# Altium project stm32f407vg.PrjPCB
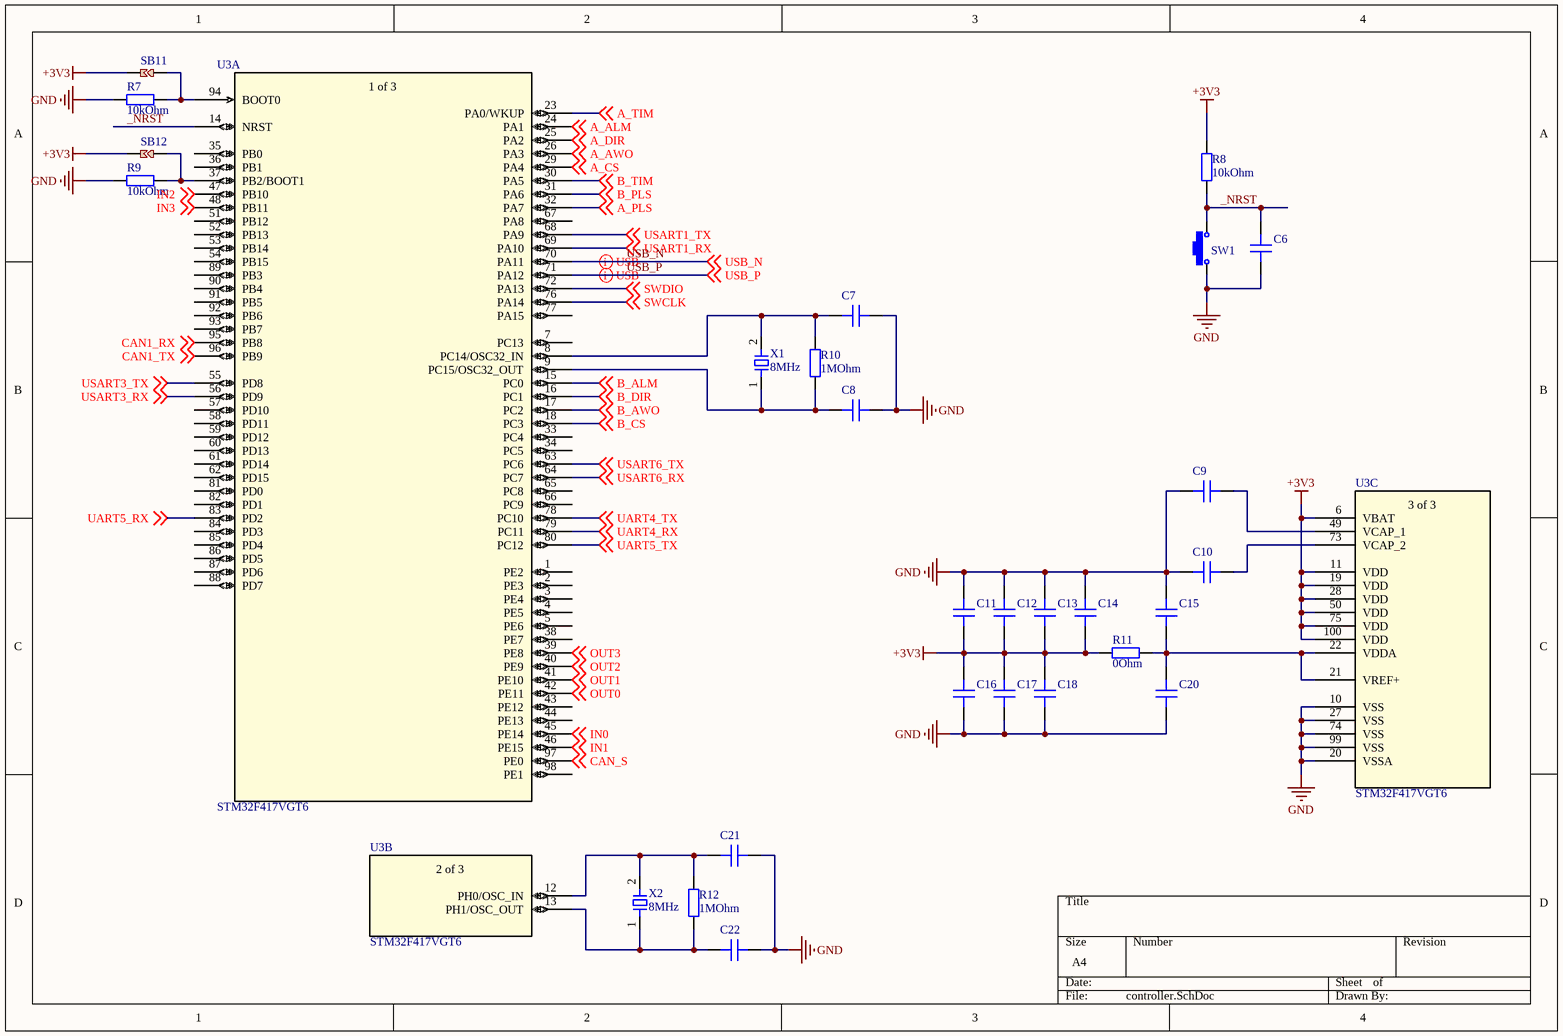
[diagram p0: controller.SchDoc]
5 sheets, 135 parts. Net scope: global (net labels, ports and power ports of the same name join across sheets).
Board file: PCB1.PcbDoc
Sheets:
  controller.SchDoc
  connectivity.SchDoc
  power.SchDoc
  io_TS.SchDoc
  stepper.SchDoc

## Sheet controller.SchDoc
size A4

### Parts
C6  100nF  [CAP 0805]  (value not drawn)
C7  100nF  [CAP 0805]  (value not drawn)
C8  100nF  [CAP 0805]  (value not drawn)
C9  100nF  [CAP 0805]  (value not drawn)
C10  100nF  [CAP 0805]  (value not drawn)
C11  100nF  [CAP 0805]  (value not drawn)
C12  100nF  [CAP 0805]  (value not drawn)
C13  100nF  [CAP 0805]  (value not drawn)
C14  100nF  [CAP 0805]  (value not drawn)
C15  100nF  [CAP 0805]  (value not drawn)
C16  100nF  [CAP 0805]  (value not drawn)
C17  100nF  [CAP 0805]  (value not drawn)
C18  100nF  [CAP 0805]  (value not drawn)
C20  100nF  [CAP 0805]  (value not drawn)
C21  100nF  [CAP 0805]  (value not drawn)
C22  100nF  [CAP 0805]  (value not drawn)
R7  value 10kOhm  [RES 0805]  (hidden comment: Resistor)
R8  value 10kOhm  [RES 0805]  (hidden comment: Resistor)
R9  value 10kOhm  [RES 0805]  (hidden comment: Resistor)
R10  value 1MOhm  [RES 0805]  (hidden comment: Resistor)
R11  value 0Ohm  [RES 0805]  (hidden comment: Resistor)
R12  value 1MOhm  [RES 0805]  (hidden comment: Resistor)
SB11  SB  [Solder Bridge]  (value not drawn)
SB12  SB  [Solder Bridge]  (value not drawn)
SW1  Button  [TSW SMD-3*6*2.5]  (value not drawn)
U3  STM32F417VGT6  [LQFP100-14×14mm]  (parts A,B,C of 3)
X1  8MHz  [XTAL 3215]
X2  8MHz  [XTAL 3225]

### Nets
+3V3: C11.1 C12.1 C13.1 C14.1 C16.2 C17.2 C18.2 R8.2 R11.1 SB11.1 SB12.1 U3.6(VBAT) U3.11(VDD) U3.19(VDD) U3.28(VDD) U3.50(VDD) U3.75(VDD) U3.100(VDD)
GND: C6.1 C7.2 C8.2 C9.2 C10.2 C11.2 C12.2 C13.2 C14.2 C15.2 C16.1 C17.1 C18.1 C20.1 C21.2 C22.2 R7.2 R9.2 SW1.1 U3.10(VSS) U3.20(VSSA) U3.27(VSS) U3.74(VSS) U3.99(VSS)
_NRST: C6.2 R8.1 SW1.2 U3.14(NRST)
A_ALM: U3.24(PA1) ; off-sheet A_ALM
A_AWO: U3.26(PA3) ; off-sheet A_AWO
A_CS: U3.29(PA4) ; off-sheet A_CS
A_DIR: U3.25(PA2) ; off-sheet A_DIR
A_PLS: U3.32(PA7) ; off-sheet A_PLS
A_TIM: U3.23(PA0/WKUP) ; off-sheet A_TIM
B_ALM: U3.15(PC0) ; off-sheet B_ALM
B_AWO: U3.17(PC2) ; off-sheet B_AWO
B_CS: U3.18(PC3) ; off-sheet B_CS
B_DIR: U3.16(PC1) ; off-sheet B_DIR
B_PLS: U3.31(PA6) ; off-sheet B_PLS
B_TIM: U3.30(PA5) ; off-sheet B_TIM
CAN1_RX: U3.95(PB8) ; off-sheet CAN1_RX
CAN1_TX: U3.96(PB9) ; off-sheet CAN1_TX
CAN_S: U3.97(PE0) ; off-sheet CAN_S
IN0: U3.45(PE14) ; off-sheet IN0
IN1: U3.46(PE15) ; off-sheet IN1
IN2: U3.47(PB10) ; off-sheet IN2
IN3: U3.48(PB11) ; off-sheet IN3
OUT0: U3.42(PE11) ; off-sheet OUT0
OUT1: U3.41(PE10) ; off-sheet OUT1
OUT2: U3.40(PE9) ; off-sheet OUT2
OUT3: U3.39(PE8) ; off-sheet OUT3
SWCLK: U3.76(PA14) ; off-sheet SWCLK
SWDIO: U3.72(PA13) ; off-sheet SWDIO
UART4_RX: U3.79(PC11) ; off-sheet UART4_RX
UART4_TX: U3.78(PC10) ; off-sheet UART4_TX
UART5_RX: U3.83(PD2) ; off-sheet UART5_RX
UART5_TX: U3.80(PC12) ; off-sheet UART5_TX
USART1_RX: U3.69(PA10) ; off-sheet USART1_RX
USART1_TX: U3.68(PA9) ; off-sheet USART1_TX
USART3_RX: U3.56(PD9) ; off-sheet USART3_RX
USART3_TX: U3.55(PD8) ; off-sheet USART3_TX
USART6_RX: U3.64(PC7) ; off-sheet USART6_RX
USART6_TX: U3.63(PC6) ; off-sheet USART6_TX
USB_N: U3.70(PA11) ; off-sheet USB_N
USB_P: U3.71(PA12) ; off-sheet USB_P
NetC7_1: C7.1 R10.2 U3.8(PC14/OSC32_IN) X1.2
NetC8_1: C8.1 R10.1 U3.9(PC15/OSC32_OUT) X1.1
NetC9_1: C9.1 U3.49(VCAP_1)
NetC10_1: C10.1 U3.73(VCAP_2)
NetC15_1: C15.1 C20.2 R11.2 U3.21(VREF+) U3.22(VDDA)
NetC21_1: C21.1 R12.2 U3.12(PH0/OSC_IN) X2.2
NetC22_1: C22.1 R12.1 U3.13(PH1/OSC_OUT) X2.1
NetR7_1: R7.1 SB11.2 U3.94(BOOT0)
NetR9_1: R9.1 SB12.2 U3.37(PB2/BOOT1)

Not connected (* = marked no-connect by the designer): U3 1(PE2) 2(PE3) 3(PE4) 4(PE5) 5(PE6) 7(PC13) 33(PC4) 34(PC5) 35(PB0) 36(PB1) 38(PE7) 43(PE12) 44(PE13) 51(PB12) 52(PB13) 53(PB14) 54(PB15) 57(PD10) 58(PD11) 59(PD12) 60(PD13) 61(PD14) 62(PD15) 65(PC8) 66(PC9) 67(PA8) 77(PA15) 81(PD0) 82(PD1) 84(PD3) 85(PD4) 86(PD5) 87(PD6) 88(PD7) 89(PB3) 90(PB4) 91(PB5) 92(PB6) 93(PB7) 98(PE1)

### Layout directives
differential pair: USB_N, USB_P

### Notes on the sheet
- (in symbol STM32F417VGT6, part A) 1 of 3
- (in symbol STM32F417VGT6, part B) 2 of 3
- (in symbol STM32F417VGT6, part C) 3 of 3

### Library data of the parts
C6-C18 C20-C22 = Cap: Non-polar capacitor; Published: 8-Jun-2000; LatestRevisionDate: 17-Jul-2002; LatestRevisionNote: Re-released for DXP Platform.; PackageReference: RAD-0.3; Publisher: Altium Limited; PackageDescription: Radial Cap, Thru-Hole; 2 Leads; 0.3 in Pin Spacing
R7-R12 = Res: Published: 8-Jun-2000; LatestRevisionDate: 17-Jul-2002; LatestRevisionNote: Re-released for DXP Platform.; PackageReference: AXIAL-0.4; Publisher: Altium Limited; PackageDescription: Axial Device, Thru-Hole; 2 Leads; 0.4 in Pin Spacing
SW1 = BTN: BOM名称: 3x6轻触开关; 版权归属: 黎明电子style; 学习资源: https://lmdzstyle.taobao.com/
U3 = STM32F417VGT6: No Description Available; SourceLibrary: Updates_to_database_2020-10-19; Built_By: EMA_UL_Team; Vendor: STMicroelectronics; Copyright: Copyright (C) 2018 Accelerated Designs. All rights reserved; Manufacturer_Part_Number: STM32F417VGT6; RefDes: RefDes; Type: DEV
X1 = XTAL: Passive Oscillator; BOM名称: 2脚晶振; 版权归属: 黎明电子style; 学习资源: https://lmdzstyle.taobao.com/
X2 = XTAL: Passive Oscillator; pin to pad: 2>3; BOM名称: 2脚晶振; 版权归属: 黎明电子style; 学习资源: https://lmdzstyle.taobao.com/

## Sheet connectivity.SchDoc
size A4
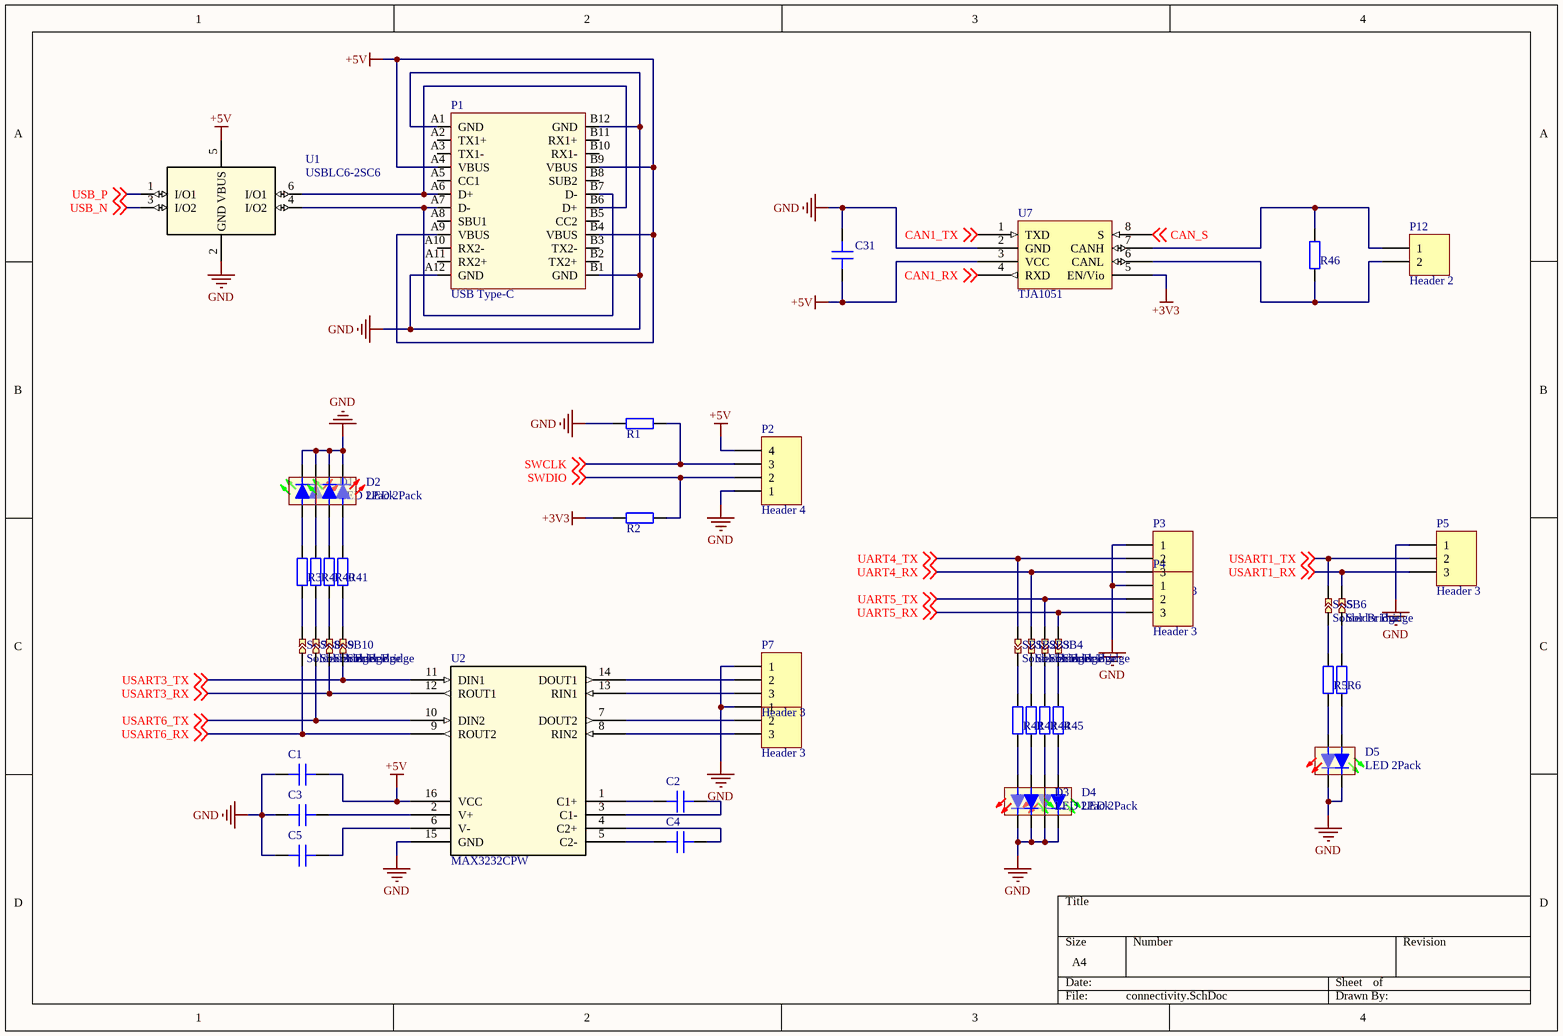
[diagram p1: connectivity.SchDoc]

### Parts
C1  100nF  [CAP 0805]  (value not drawn)
C2  100nF  [CAP 0805]  (value not drawn)
C3  100nF  [CAP 0805]  (value not drawn)
C4  100nF  [CAP 0805]  (value not drawn)
C5  100nF  [CAP 0805]  (value not drawn)
C31  100nF  [CAP 0805]  (value not drawn)
D1  LED 2Pack  [LED-1615]
D2  LED 2Pack  [LED-1615]
D3  LED 2Pack  [LED-1615]
D4  LED 2Pack  [LED-1615]
D5  LED 2Pack  [LED-1615]
P1  USB Type-C  [USB Type-C 24P]
P2  Header 4  [HDR1X4]
P3  Header 3  [MOLEX 53426-0310]
P4  Header 3  [MOLEX 53426-0310]
P5  Header 3  [MOLEX 53426-0310]
P6  Header 3  [MOLEX 53426-0310]
P7  Header 3  [MOLEX 53426-0310]
P12  Header 2  [MOLEX 53426-0210]
R1  10kOhm  [RES 0805]  (value not drawn)
R2  10kOhm  [RES 0805]  (value not drawn)
R3  10kOhm  [RES 0805]  (value not drawn)
R4  10kOhm  [RES 0805]  (value not drawn)
R5  10kOhm  [RES 0805]  (value not drawn)
R6  10kOhm  [RES 0805]  (value not drawn)
R40  10kOhm  [RES 0805]  (value not drawn)
R41  10kOhm  [RES 0805]  (value not drawn)
R42  10kOhm  [RES 0805]  (value not drawn)
R43  10kOhm  [RES 0805]  (value not drawn)
R44  10kOhm  [RES 0805]  (value not drawn)
R45  10kOhm  [RES 0805]  (value not drawn)
R46  10kOhm  [RES 0805]  (value not drawn)
SB1  Solder Bridge  [Solder Bridge]
SB2  Solder Bridge  [Solder Bridge]
SB3  Solder Bridge  [Solder Bridge]
SB4  Solder Bridge  [Solder Bridge]
SB5  Solder Bridge  [Solder Bridge]
SB6  Solder Bridge  [Solder Bridge]
SB7  Solder Bridge  [Solder Bridge]
SB8  Solder Bridge  [Solder Bridge]
SB9  Solder Bridge  [Solder Bridge]
SB10  Solder Bridge  [Solder Bridge]
U1  USBLC6-2SC6  [SOT23-6L_STM]
U2  MAX3232CPW  [TSSOP-16]
U7  TJA1051  [SO-8]

### Nets
+3V3: R2.2 U7.5(EN/Vio)
+5V: C1.2 C31.1 P1.A4(VBUS) P1.A9(VBUS) P1.B4(VBUS) P1.B9(VBUS) P2.4 U1.5(VBUS) U2.16(VCC) U7.3(VCC)
GND: C1.1 C3.1 C5.1 C31.2 D1.1(RK) D1.2(GK) D2.1(RK) D2.2(GK) D3.1(RK) D3.2(GK) D4.1(RK) D4.2(GK) D5.1(RK) D5.2(GK) P1.A1(GND) P1.A12(GND) P1.B1(GND) P1.B12(GND) P2.1 P3.1 P4.1 P5.1 P6.1 P7.1 R1.2 U1.2(GND) U2.15(GND) U7.2(GND)
CAN1_RX: U7.4(RXD) ; off-sheet CAN1_RX
CAN1_TX: U7.1(TXD) ; off-sheet CAN1_TX
CAN_S: U7.8(S) ; off-sheet CAN_S
SWCLK: P2.3 R1.1 ; off-sheet SWCLK
SWDIO: P2.2 R2.1 ; off-sheet SWDIO
UART4_RX: P3.3 SB2.2 ; off-sheet UART4_RX
UART4_TX: P3.2 SB1.2 ; off-sheet UART4_TX
UART5_RX: P4.3 SB4.2 ; off-sheet UART5_RX
UART5_TX: P4.2 SB3.2 ; off-sheet UART5_TX
USART1_RX: P5.3 SB6.1 ; off-sheet USART1_RX
USART1_TX: P5.2 SB5.1 ; off-sheet USART1_TX
USART3_RX: SB9.2 U2.12(ROUT1) ; off-sheet USART3_RX
USART3_TX: SB10.2 U2.11(DIN1) ; off-sheet USART3_TX
USART6_RX: SB7.2 U2.9(ROUT2) ; off-sheet USART6_RX
USART6_TX: SB8.2 U2.10(DIN2) ; off-sheet USART6_TX
USB_N: U1.3(I/O2) ; off-sheet USB_N
USB_P: U1.1(I/O1) ; off-sheet USB_P
NetC2_1: C2.1 U2.1(C1+)
NetC2_2: C2.2 U2.3(C1-)
NetC3_2: C3.2 U2.2(V+)
NetC4_1: C4.1 U2.5(C2-)
NetC4_2: C4.2 U2.4(C2+)
NetC5_2: C5.2 U2.6(V-)
NetD1_3: D1.3(GA) R3.2
NetD1_4: D1.4(RA) R4.2
NetD2_3: D2.3(GA) R40.2
NetD2_4: D2.4(RA) R41.2
NetD3_3: D3.3(GA) R43.1
NetD3_4: D3.4(RA) R42.1
NetD4_3: D4.3(GA) R45.1
NetD4_4: D4.4(RA) R44.1
NetD5_3: D5.3(GA) R6.1
NetD5_4: D5.4(RA) R5.1
NetP1_A6: P1.A6(D+) P1.B6(D+) U1.6(I/O1)
NetP1_A7: P1.A7(D-) P1.B7(D-) U1.4(I/O2)
NetP6_2: P6.2 U2.7(DOUT2)
NetP6_3: P6.3 U2.8(RIN2)
NetP7_2: P7.2 U2.14(DOUT1)
NetP7_3: P7.3 U2.13(RIN1)
NetP12_1: P12.1 R46.1 U7.7(CANH)
NetP12_2: P12.2 R46.2 U7.6(CANL)
NetR3_1: R3.1 SB7.1
NetR4_1: R4.1 SB8.1
NetR5_2: R5.2 SB5.2
NetR6_2: R6.2 SB6.2
NetR40_1: R40.1 SB9.1
NetR41_1: R41.1 SB10.1
NetR42_2: R42.2 SB1.1
NetR43_2: R43.2 SB2.1
NetR44_2: R44.2 SB3.1
NetR45_2: R45.2 SB4.1

Not connected (* = marked no-connect by the designer): P1 A2(TX1+) A3(TX1-) A5(CC1) A8(SBU1) A10(RX2-) A11(RX2+) B2(TX2+) B3(TX2-) B5(CC2) B8(SUB2) B10(RX1-) B11(RX1+)

### Library data of the parts
C1-C5 C31 = Cap: Non-polar capacitor; Published: 8-Jun-2000; LatestRevisionDate: 17-Jul-2002; LatestRevisionNote: Re-released for DXP Platform.; PackageReference: RAD-0.3; Publisher: Altium Limited; PackageDescription: Radial Cap, Thru-Hole; 2 Leads; 0.3 in Pin Spacing
D1-D5 = LED 2Pack: Two seperate LEDs packed together.
P2 = Header 4: Header, 4-Pin; LatestRevisionDate: 17-Jul-2002; LatestRevisionNote: Re-released for DXP Platform.; Publisher: Altium Limited
P3-P7 = Header 3: Header, 3-Pin; LatestRevisionDate: 17-Jul-2002; LatestRevisionNote: Re-released for DXP Platform.; Publisher: Altium Limited
P12 = Header 2: Header, 2-Pin; LatestRevisionDate: 17-Jul-2002; LatestRevisionNote: Re-released for DXP Platform.; Publisher: Altium Limited
R1-R6 R40-R46 = Res: Resistor; Published: 8-Jun-2000; LatestRevisionDate: 17-Jul-2002; LatestRevisionNote: Re-released for DXP Platform.; PackageReference: AXIAL-0.4; Publisher: Altium Limited; PackageDescription: Axial Device, Thru-Hole; 2 Leads; 0.4 in Pin Spacing
U2 = MAX3232CPW: 3-V to 5.5-V Multichannel RS-232 Line Driver/Receiver; Manufacturer: Texas Instruments; INDUSTRY_STD_PKG_TYPE: TSSOP; PIN_COUNT: 16; PACKAGE_DESIGNATOR: PW; Datasheet_URL: http://www.ti.com/lit/gpn/MAX3232; FAMILY_NAME: RS-232; GENERIC_PART_NUMBER: MAX3232; Vendor: Texas Instruments; Manufacturer_Part_Number: MAX3232CPW; Copyright: Copyright (C) 2021 Accelerated Designs. All rights reserved; RefDes: RefDes; Type: DEV
U7 = TJA1051: High-speed CAN transceiver

## Sheet power.SchDoc
size A4
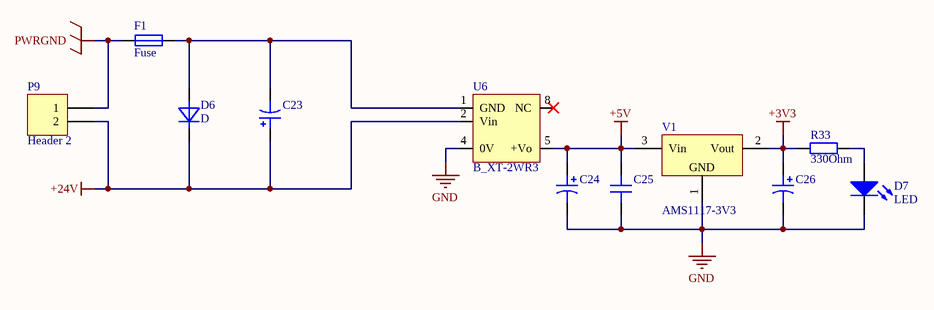
[diagram p2: power.SchDoc]

### Parts
C23  1uF  [TC3528-1411]  (value not drawn)
C24  10uF  [TC3528-1411]  (value not drawn)
C25  100nF  [CAP 0805]  (value not drawn)
C26  100uF  [TC7343-2917]  (value not drawn)
D6  D  [CD3216-1206]
D7  LED  [CD2012-0805]
F1  Fuse  [RES 1210]
P9  Header 2  [XT30PW-M]
R33  value 330Ohm  [RES 0805]  (hidden comment: Resistor)
U6  B_XT-2WR3  [B_XT-2WR3]
V1  AMS1117-3V3  [SOT-223]

### Nets
+3V3: C26.1 R33.1 V1.2(Vout)
+5V: C24.1 C25.2 U6.5(+Vo) V1.3(Vin)
+24V: C23.1 D6.2 P9.2 U6.2(Vin)
GND: C24.2 C25.1 C26.2 D7.2(K) U6.4(0V) V1.1(GND)
PWRGND: F1.1 P9.1
NetC23_2: C23.2 D6.1 F1.2 U6.1(GND)
NetD7_1: D7.1(A) R33.2

Not connected (* = marked no-connect by the designer): U6 8(NC)*

### Library data of the parts
C23 C24 C26 = Cap Pol: Capacitor; Published: 23-Sep-2002; PackageReference: CAPR5-4X5; Publisher: Altium Limited; PackageDescription: Capacitor; 2 Leads
C25 = Cap: Non-polar capacitor; Published: 8-Jun-2000; LatestRevisionDate: 17-Jul-2002; LatestRevisionNote: Re-released for DXP Platform.; PackageReference: RAD-0.3; Publisher: Altium Limited; PackageDescription: Radial Cap, Thru-Hole; 2 Leads; 0.3 in Pin Spacing
P9 = Header 2: Header, 2-Pin; LatestRevisionDate: 17-Jul-2002; LatestRevisionNote: Re-released for DXP Platform.; Publisher: Altium Limited
R33 = Res: Published: 8-Jun-2000; LatestRevisionDate: 17-Jul-2002; LatestRevisionNote: Re-released for DXP Platform.; PackageReference: AXIAL-0.4; Publisher: Altium Limited; PackageDescription: Axial Device, Thru-Hole; 2 Leads; 0.4 in Pin Spacing
V1 = AMS1117: 三端稳压芯片; BOM名称: 稳压芯片; 版权归属: 黎明电子style; 学习资源: https://lmdzstyle.taobao.com/
D7 = LED: Published: 8-Jun-2000; LatestRevisionDate: 08-Jul-2005; LatestRevisionNote: Mech Layer 1 removed.; PackageReference: LED-0; Publisher: Altium Limited; PackageDescription: LED; 2 Leads
F1 = Fuse: Published: 8-Jun-2000; LatestRevisionDate: 17-Jul-2002; LatestRevisionNote: Re-released for DXP Platform.; PackageReference: PIN-W2/E2.8; Publisher: Altium Limited; PackageDescription: Thru-Hole; 2 Leads

## Sheet io_TS.SchDoc
size A4
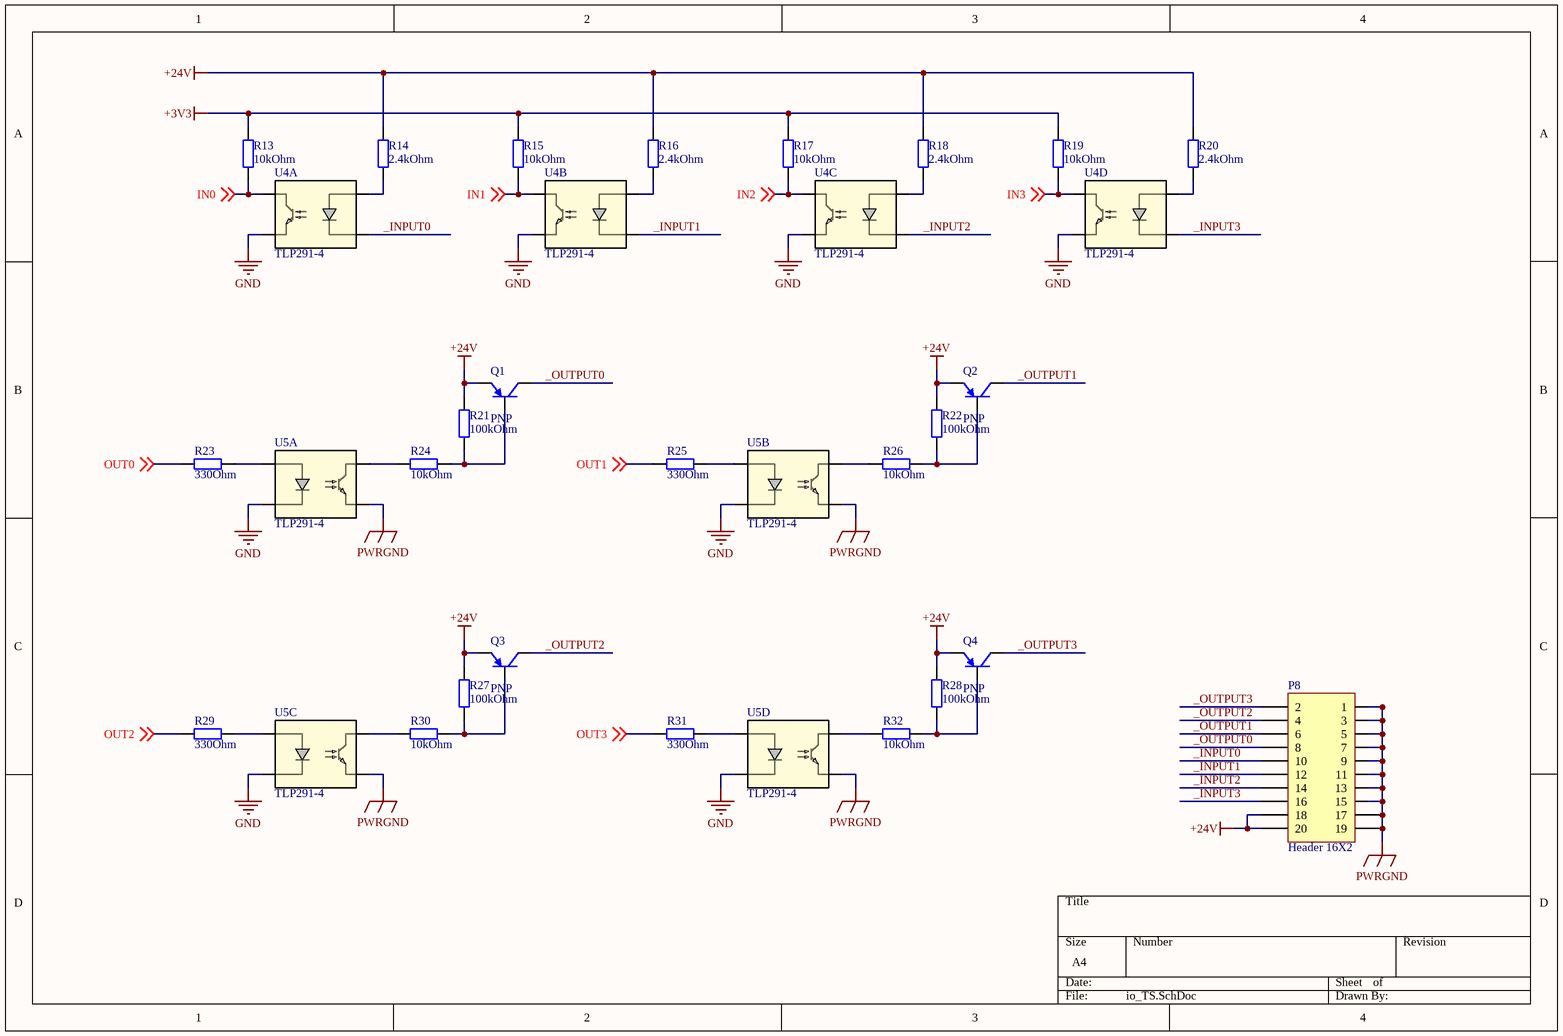
[diagram p3: io_TS.SchDoc]

### Parts
P8  Header 16X2  [MOLEX 505448-2071]
Q1  PNP  [SOT-89]
Q2  PNP  [SOT-89]
Q3  PNP  [SOT-89]
Q4  PNP  [SOT-89]
R13  value 10kOhm  [RES 0805]  (hidden comment: Resistor)
R14  value 2.4kOhm  [RES 0805]  (hidden comment: Resistor)
R15  value 10kOhm  [RES 0805]  (hidden comment: Resistor)
R16  value 2.4kOhm  [RES 0805]  (hidden comment: Resistor)
R17  value 10kOhm  [RES 0805]  (hidden comment: Resistor)
R18  value 2.4kOhm  [RES 0805]  (hidden comment: Resistor)
R19  value 10kOhm  [RES 0805]  (hidden comment: Resistor)
R20  value 2.4kOhm  [RES 0805]  (hidden comment: Resistor)
R21  value 100kOhm  [RES 0805]  (hidden comment: Resistor)
R22  value 100kOhm  [RES 0805]  (hidden comment: Resistor)
R23  value 330Ohm  [RES 0805]  (hidden comment: Resistor)
R24  value 10kOhm  [RES 0805]  (hidden comment: Resistor)
R25  value 330Ohm  [RES 0805]  (hidden comment: Resistor)
R26  value 10kOhm  [RES 0805]  (hidden comment: Resistor)
R27  value 100kOhm  [RES 0805]  (hidden comment: Resistor)
R28  value 100kOhm  [RES 0805]  (hidden comment: Resistor)
R29  value 330Ohm  [RES 0805]  (hidden comment: Resistor)
R30  value 10kOhm  [RES 0805]  (hidden comment: Resistor)
R31  value 330Ohm  [RES 0805]  (hidden comment: Resistor)
R32  value 10kOhm  [RES 0805]  (hidden comment: Resistor)
U4  TLP291-4  [SO-16]  (parts A,B,C,D of 4)
U5  TLP291-4  [SO-16]  (parts A,B,C,D of 4)

### Nets
+3V3: R13.2 R15.2 R17.2 R19.2
+24V: P8.18 P8.20 Q1.2(E) Q2.2(E) Q3.2(E) Q4.2(E) R14.2 R16.2 R18.2 R20.2 R21.2 R22.2 R27.2 R28.2
GND: U4.9 U4.11 U4.13 U4.15 U5.2 U5.4 U5.6 U5.8
PWRGND: P8.1 P8.3 P8.5 P8.7 P8.9 P8.11 P8.13 P8.15 P8.17 P8.19 U5.9 U5.11 U5.13 U5.15
_INPUT0: P8.10 U4.2
_INPUT1: P8.12 U4.4
_INPUT2: P8.14 U4.6
_INPUT3: P8.16 U4.8
_OUTPUT0: P8.8 Q1.3(C)
_OUTPUT1: P8.6 Q2.3(C)
_OUTPUT2: P8.4 Q3.3(C)
_OUTPUT3: P8.2 Q4.3(C)
IN0: R13.1 U4.16 ; off-sheet IN0
IN1: R15.1 U4.14 ; off-sheet IN1
IN2: R17.1 U4.12 ; off-sheet IN2
IN3: R19.1 U4.10 ; off-sheet IN3
OUT0: R23.2 ; off-sheet OUT0
OUT1: R25.2 ; off-sheet OUT1
OUT2: R29.2 ; off-sheet OUT2
OUT3: R31.2 ; off-sheet OUT3
NetQ1_1: Q1.1(B) R21.1 R24.1
NetQ2_1: Q2.1(B) R22.1 R26.1
NetQ3_1: Q3.1(B) R27.1 R30.1
NetQ4_1: Q4.1(B) R28.1 R32.1
NetR14_1: R14.1 U4.1
NetR16_1: R16.1 U4.3
NetR18_1: R18.1 U4.5
NetR20_1: R20.1 U4.7
NetR23_1: R23.1 U5.1
NetR24_2: R24.2 U5.16
NetR25_1: R25.1 U5.3
NetR26_2: R26.2 U5.14
NetR29_1: R29.1 U5.5
NetR30_2: R30.2 U5.12
NetR31_1: R31.1 U5.7
NetR32_2: R32.2 U5.10

### Library data of the parts
P8 = Header 10X2: Header, 32-Pin; LatestRevisionDate: 17-Jul-2002; LatestRevisionNote: Re-released for DXP Platform.; Publisher: Altium Limited
Q1-Q4 = PNP: PNP Bipolar Transistor (for SOT23-3 only).; pin to pad: 2>3 3>2; Published: 8-Jun-2000; LatestRevisionDate: 29-May-2009; LatestRevisionNote: IPC-7351 Footprint Added.; PackageVersion: Aug-1999; PackageReference: SOT-23B; Publisher: Altium Limited; PackageDescription: 3-Pin SOT-23 Package 0.95 mm Pitch, 2.4 mm Lead Span
R13-R32 = Res: Published: 8-Jun-2000; LatestRevisionDate: 17-Jul-2002; LatestRevisionNote: Re-released for DXP Platform.; PackageReference: AXIAL-0.4; Publisher: Altium Limited; PackageDescription: Axial Device, Thru-Hole; 2 Leads; 0.4 in Pin Spacing
U4 U5 = TLP291-4: No Description Available; Vendor: Toshiba; SourceLibrary: Toshiba_2019-02-06; Source_Package: TLP291_4; Number_devices_in_Package: 1; Copyright: Copyright (C) 2018 Accelerated Designs. All rights reserved; Manufacturer_Part_Number: TLP291-4; RefDes: RefDes; Type: DEV

## Sheet stepper.SchDoc
size A4
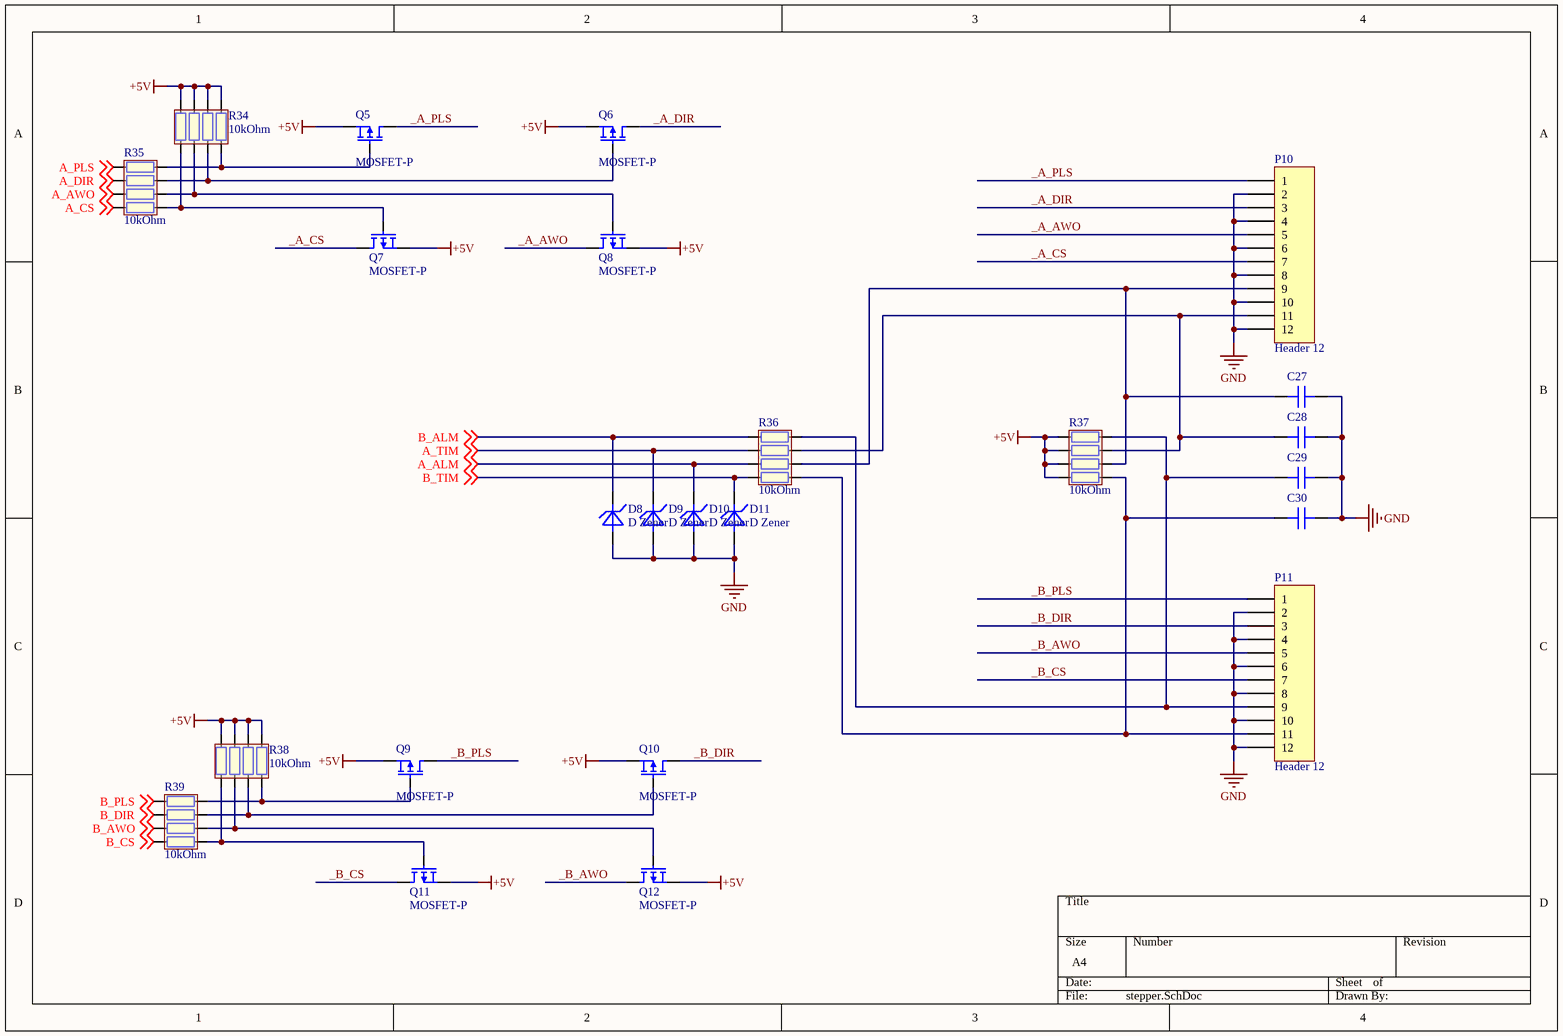
[diagram p4: stepper.SchDoc]

### Parts
C27  100nF  [CAP 0805]  (value not drawn)
C28  100nF  [CAP 0805]  (value not drawn)
C29  100nF  [CAP 0805]  (value not drawn)
C30  100nF  [CAP 0805]  (value not drawn)
D8  D Zener  [CD3216-1206]
D9  D Zener  [CD3216-1206]
D10  D Zener  [CD3216-1206]
D11  D Zener  [CD3216-1206]
P10  Header 12  [MOLEX 53426-1210]
P11  Header 12  [MOLEX 53426-1210]
Q5  MOSFET-P  [SOT23-3]
Q6  MOSFET-P  [SOT23-3]
Q7  MOSFET-P  [SOT23-3]
Q8  MOSFET-P  [SOT23-3]
Q9  MOSFET-P  [SOT23-3]
Q10  MOSFET-P  [SOT23-3]
Q11  MOSFET-P  [SOT23-3]
Q12  MOSFET-P  [SOT23-3]
R34  10kOhm  [RES 0603 4PACK]
R35  10kOhm  [RES 0603 4PACK]
R36  10kOhm  [RES 0603 4PACK]
R37  10kOhm  [RES 0603 4PACK]
R38  10kOhm  [RES 0603 4PACK]
R39  10kOhm  [RES 0603 4PACK]

### Nets
+5V: Q5.2(S) Q6.2(S) Q7.2(S) Q8.2(S) Q9.2(S) Q10.2(S) Q11.2(S) Q12.2(S) R34.5 R34.6 R34.7 R34.8 R37.5 R37.6 R37.7 R37.8 R38.5 R38.6 R38.7 R38.8
GND: C27.2 C28.2 C29.2 C30.2 D8.1 D9.1 D10.1 D11.1 P10.2 P10.4 P10.6 P10.8 P10.10 P10.12 P11.2 P11.4 P11.6 P11.8 P11.10 P11.12
_A_AWO: P10.5 Q8.3(D)
_A_CS: P10.7 Q7.3(D)
_A_DIR: P10.3 Q6.3(D)
_A_PLS: P10.1 Q5.3(D)
_B_AWO: P11.5 Q12.3(D)
_B_CS: P11.7 Q11.3(D)
_B_DIR: P11.3 Q10.3(D)
_B_PLS: P11.1 Q9.3(D)
A_ALM: D10.2 R36.6 ; off-sheet A_ALM
A_AWO: R35.6 ; off-sheet A_AWO
A_CS: R35.5 ; off-sheet A_CS
A_DIR: R35.7 ; off-sheet A_DIR
A_PLS: R35.8 ; off-sheet A_PLS
A_TIM: D9.2 R36.7 ; off-sheet A_TIM
B_ALM: D8.2 R36.8 ; off-sheet B_ALM
B_AWO: R39.6 ; off-sheet B_AWO
B_CS: R39.5 ; off-sheet B_CS
B_DIR: R39.7 ; off-sheet B_DIR
B_PLS: R39.8 ; off-sheet B_PLS
B_TIM: D11.2 R36.5 ; off-sheet B_TIM
NetC27_1: C27.1 P10.9 R36.3 R37.2
NetC28_1: C28.1 P10.11 R36.2 R37.3
NetC29_1: C29.1 P11.9 R36.1 R37.4
NetC30_1: C30.1 P11.11 R36.4 R37.1
NetQ5_1: Q5.1(G) R34.4 R35.1
NetQ6_1: Q6.1(G) R34.3 R35.2
NetQ7_1: Q7.1(G) R34.1 R35.4
NetQ8_1: Q8.1(G) R34.2 R35.3
NetQ9_1: Q9.1(G) R38.4 R39.1
NetQ10_1: Q10.1(G) R38.3 R39.2
NetQ11_1: Q11.1(G) R38.1 R39.4
NetQ12_1: Q12.1(G) R38.2 R39.3

### Library data of the parts
C27-C30 = Cap: Non-polar capacitor; Published: 8-Jun-2000; LatestRevisionDate: 17-Jul-2002; LatestRevisionNote: Re-released for DXP Platform.; PackageReference: RAD-0.3; Publisher: Altium Limited; PackageDescription: Radial Cap, Thru-Hole; 2 Leads; 0.3 in Pin Spacing
D8-D11 = DZ: Zener Diode; Published: 8-Jun-2000; LatestRevisionDate: 17-Jul-2002; LatestRevisionNote: Re-released for DXP Platform.; PackageReference: DIODE-0.7; Publisher: Altium Limited; PackageDescription: Diode, Thru-Hole; 2 Leads; 0.7 in Pin Spacing
P10 P11 = Header 12: Header, 12-Pin; LatestRevisionDate: 17-Jul-2002; LatestRevisionNote: Re-released for DXP Platform.; Publisher: Altium Limited
Q5-Q12 = MOSFET-P: P-Channel MOSFET; Published: 8-Jun-2000; LatestRevisionDate: 17-Jul-2002; LatestRevisionNote: Re-released for DXP Platform.; PackageVersion: 1995/1996; PackageReference: E3; Publisher: Altium Limited; PackageDescription: TO, Flat Index; 3 In-Line, Axial Leads; Body Dia. 4.6mm; Lead Dia. 0.5 mm (max)
R34-R39 = Res 4Pack

## Nets that join several sheets
+3V3: controller (18 pins), connectivity (R2.2 U7.5), power (C26.1 R33.1 V1.2), io_TS (R13.2 R15.2 R17.2 R19.2)
+5V: connectivity (10 pins), power (C24.1 C25.2 U6.5 V1.3), stepper (20 pins)
+24V: power (C23.1 D6.2 P9.2 U6.2), io_TS (14 pins)
GND: controller (24 pins), connectivity (28 pins), power (6 pins), io_TS (8 pins), stepper (20 pins)
PWRGND: power (F1.1 P9.1), io_TS (14 pins)
A_ALM: controller (U3.24), stepper (D10.2 R36.6)
A_AWO: controller (U3.26), stepper (R35.6)
A_CS: controller (U3.29), stepper (R35.5)
A_DIR: controller (U3.25), stepper (R35.7)
A_PLS: controller (U3.32), stepper (R35.8)
A_TIM: controller (U3.23), stepper (D9.2 R36.7)
B_ALM: controller (U3.15), stepper (D8.2 R36.8)
B_AWO: controller (U3.17), stepper (R39.6)
B_CS: controller (U3.18), stepper (R39.5)
B_DIR: controller (U3.16), stepper (R39.7)
B_PLS: controller (U3.31), stepper (R39.8)
B_TIM: controller (U3.30), stepper (D11.2 R36.5)
CAN1_RX: controller (U3.95), connectivity (U7.4)
CAN1_TX: controller (U3.96), connectivity (U7.1)
CAN_S: controller (U3.97), connectivity (U7.8)
IN0: controller (U3.45), io_TS (R13.1 U4.16)
IN1: controller (U3.46), io_TS (R15.1 U4.14)
IN2: controller (U3.47), io_TS (R17.1 U4.12)
IN3: controller (U3.48), io_TS (R19.1 U4.10)
OUT0: controller (U3.42), io_TS (R23.2)
OUT1: controller (U3.41), io_TS (R25.2)
OUT2: controller (U3.40), io_TS (R29.2)
OUT3: controller (U3.39), io_TS (R31.2)
SWCLK: controller (U3.76), connectivity (P2.3 R1.1)
SWDIO: controller (U3.72), connectivity (P2.2 R2.1)
UART4_RX: controller (U3.79), connectivity (P3.3 SB2.2)
UART4_TX: controller (U3.78), connectivity (P3.2 SB1.2)
UART5_RX: controller (U3.83), connectivity (P4.3 SB4.2)
UART5_TX: controller (U3.80), connectivity (P4.2 SB3.2)
USART1_RX: controller (U3.69), connectivity (P5.3 SB6.1)
USART1_TX: controller (U3.68), connectivity (P5.2 SB5.1)
USART3_RX: controller (U3.56), connectivity (SB9.2 U2.12)
USART3_TX: controller (U3.55), connectivity (SB10.2 U2.11)
USART6_RX: controller (U3.64), connectivity (SB7.2 U2.9)
USART6_TX: controller (U3.63), connectivity (SB8.2 U2.10)
USB_N: controller (U3.70), connectivity (U1.3)
USB_P: controller (U3.71), connectivity (U1.1)